# EAGLE design 9doFORK (EAGLE 8.2.2)
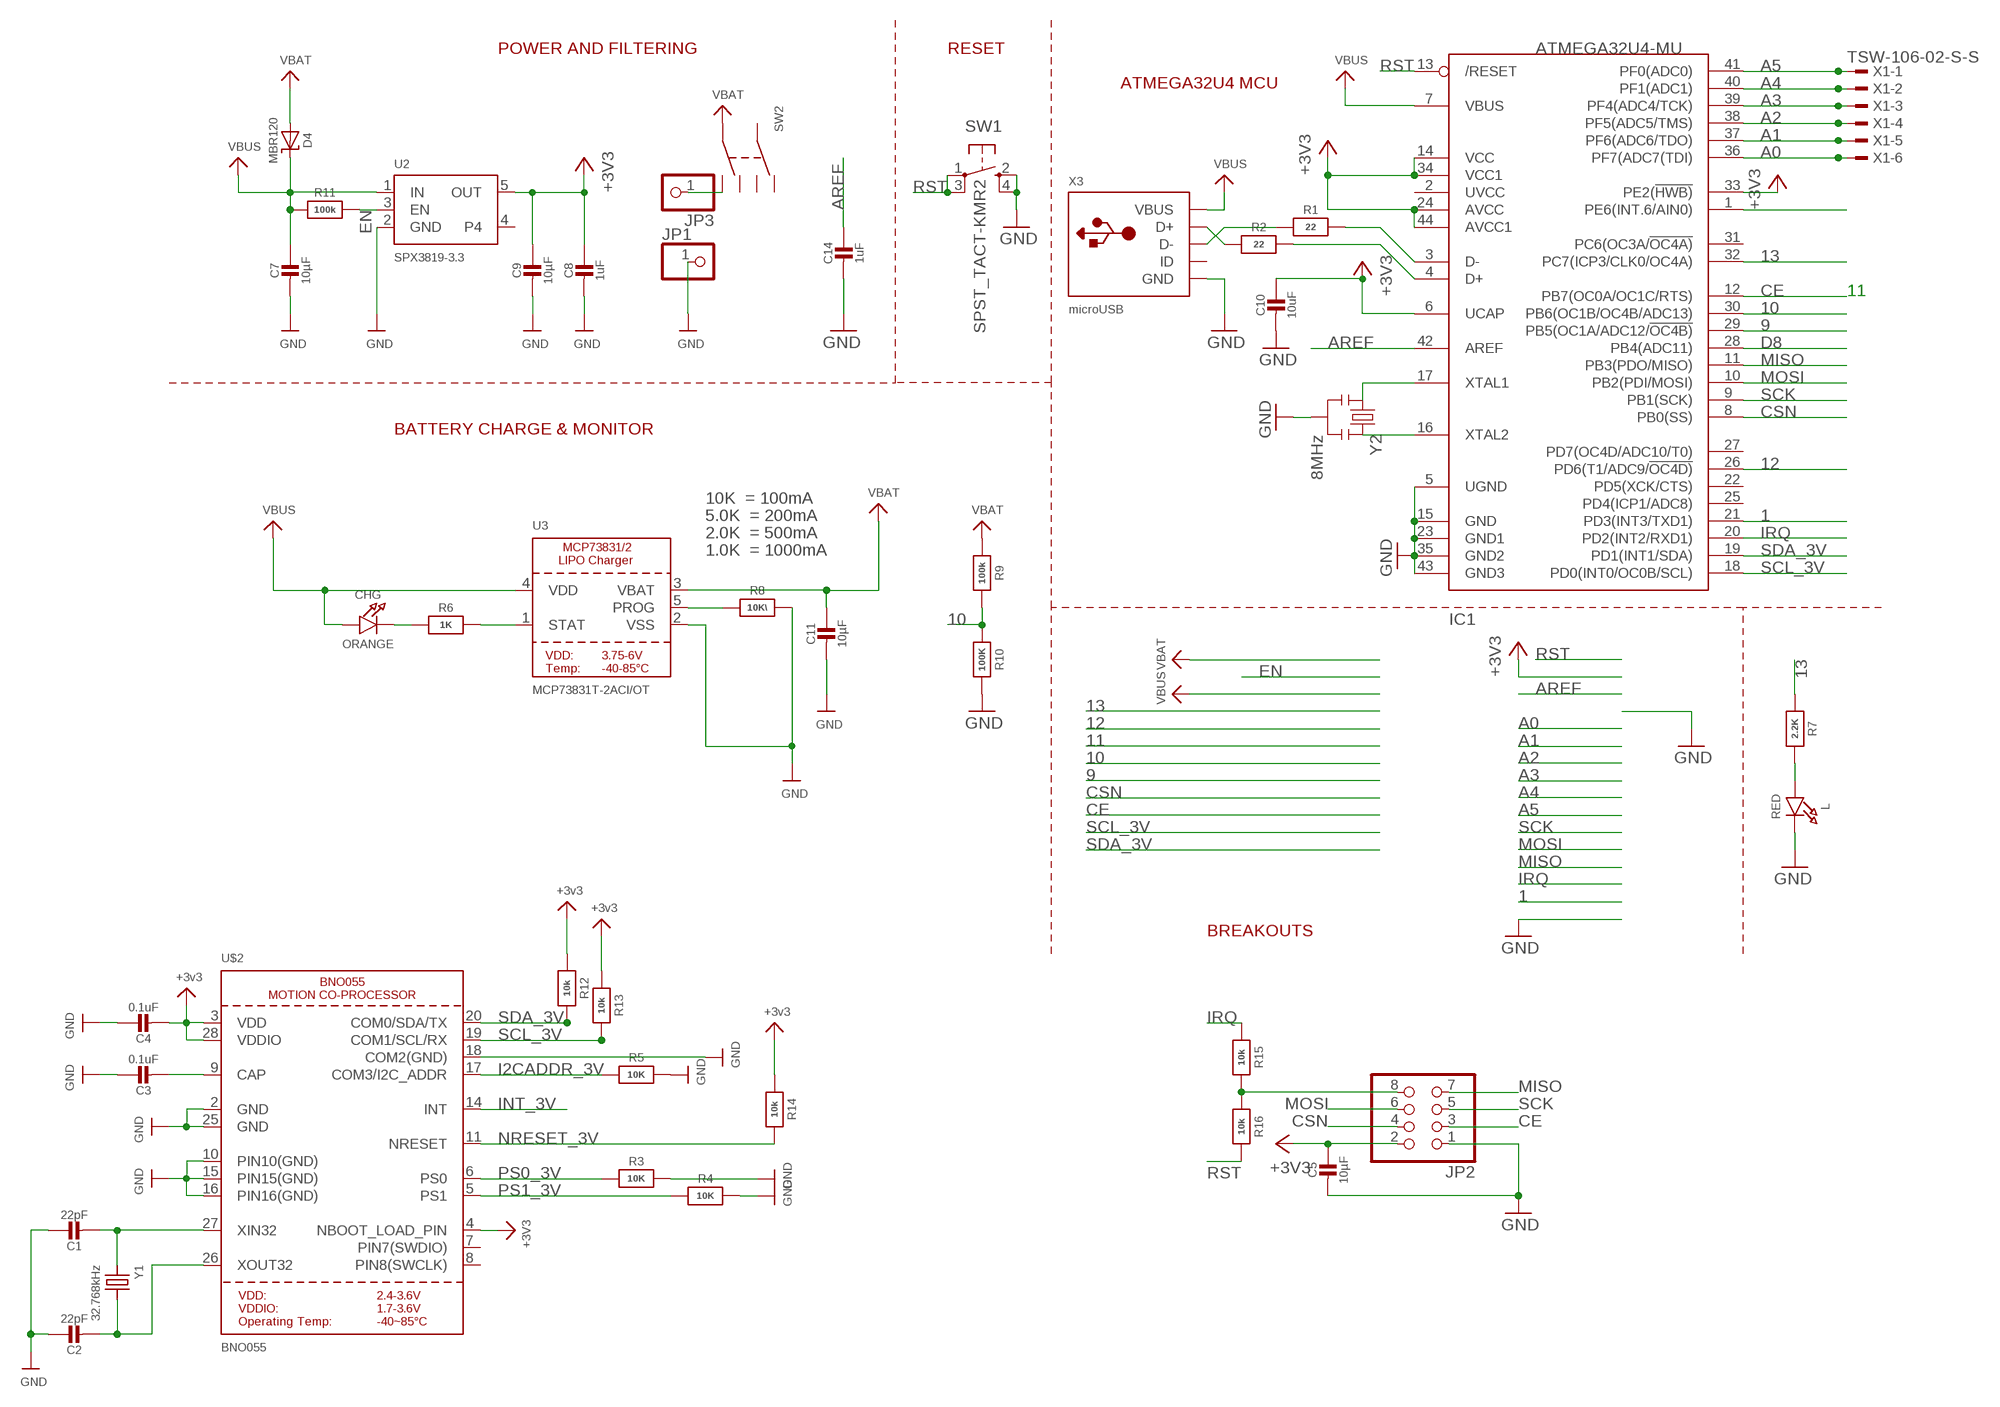
[diagram p0: schematic, sheet 1]

## Parts
C1  22pF  CAP_CERAMIC_0603  [_0603]
C2  22pF  CAP_CERAMIC_0603  [_0603]
C3  0.1uF  CAP_CERAMIC0603MINI  [0603-MINI]
C4  0.1uF  CAP_CERAMIC_0603  [_0603]
C5  10µF  CAP_CERAMIC0805-NOOUTLINE  [0805-NO]
C7  10µF  CAP_CERAMIC0805-NOOUTLINE  [0805-NO]
C8  1uF  CAP_CERAMIC0603MINI  [0603-MINI]
C9  10µF  CAP_CERAMIC0805-NOOUTLINE  [0805-NO]
C10  10uF  CAP_CERAMIC0805-NOOUTLINE  [0805-NO]
C11  10µF  CAP_CERAMIC0805-NOOUTLINE  [0805-NO]
C14  1uF  CAP_CERAMIC0603_NO  [0603-NO]
CHG  ORANGE  LED0805_NOOUTLINE  [CHIPLED_0805_NOOUTLINE]
D4  MBR120  DIODE-SCHOTTKYSOD-123  [SOD-123]
IC1  ATMEGA32U4-MU  [TQFN44_7MM]
JP1  PINHD-1X1  [1X01]
JP2  PINHD-2X4  [2X04]
JP3  PINHD-1X1  [1X01]
L  RED  LED0805  [CHIPLED_0805]
R1  22  RESISTOR0603MINI  [0603-MINI]
R2  22  RESISTOR0603MINI  [0603-MINI]
R3  10K  RESISTOR0603MINI  [0603-MINI]
R4  10K  RESISTOR0603MINI  [0603-MINI]
R5  10K  RESISTOR0603MINI  [0603-MINI]
R6  1K  RESISTOR0603MINI  [0603-MINI]
R7  2.2K  RESISTOR0603MINI  [0603-MINI]
R8  10K\  RESISTOR0603MINI  [0603-MINI]
R9  100k  RESISTOR0603MINI  [0603-MINI]
R10  100K  RESISTOR0603MINI  [0603-MINI]
R11  100k  RESISTOR0603MINI  [0603-MINI]
R12  10k  RESISTOR0603MINI  [0603-MINI]
R13  10k  RESISTOR0603MINI  [0603-MINI]
R14  10k  RESISTOR0603MINI  [0603-MINI]
R15  10k  RESISTOR0603MINI  [0603-MINI]
R16  10k  RESISTOR0603MINI  [0603-MINI]
SW1  SPST_TACT-KMR2  [KMR2]
SW2  SMT-SWITCH  [JS202011JCQN]
U2  SPX3819-3.3  VREG_SOT23-5  [SOT23-5]
U3  MCP73831T-2ACI/OT  MCP73831/2  [SOT23-5]
U$2  BNO055  [BNO055]
X1  TSW-106-02-S-S  [TSW-106-02-S-S]
X3  microUSB  USB_MICRO_20329_V2  [4UCONN_20329_V2]
Y1  32.768kHz  CRYSTAL8.0X3.8  [CRYSTAL_8X3.8]
Y2  8MHz  RESONATORSMD  [RESONATOR-SMD]

## Nets
1: IC1.21(PD3(INT3/TXD1))
9: IC1.29(PB5(OC1A/ADC12/!OC4B))
10: IC1.30(PB6(OC1B/OC4B/ADC13)) R9.2 R10.1
12: IC1.26(PD6(T1/ADC9/!OC4D))
13: IC1.32(PC7(ICP3/CLK0/OC4A)) R7.1
+3V3: C4.2 C5.1 C8.1 C9.1 C10.1 IC1.6(UCAP) IC1.14(VCC) IC1.24(AVCC) IC1.33(PE2(!HWB)) IC1.34(VCC1) IC1.44(AVCC1) JP2.2 R12.1 R13.1 R14.1 U2.5(OUT) U$2.3(VDD) U$2.4(NBOOT_LOAD_PIN) U$2.28(VDDIO) ; supply symbol labelled +3v3
A0: IC1.36(PF7(ADC7(TDI)) X1.6
A1: IC1.37(PF6(ADC6/TDO)) X1.5
A2: IC1.38(PF5(ADC5/TMS)) X1.4
A3: IC1.39(PF4(ADC4/TCK)) X1.3
A4: IC1.40(PF1(ADC1)) X1.2
A5: IC1.41(PF0(ADC0)) X1.1
AREF: C14.1 IC1.42(AREF)
CE: IC1.12(PB7(OC0A/OC1C/RTS)) JP2.3
CSN: IC1.8(PB0(SS)) JP2.4
D8: IC1.28(PB4(ADC11))
D+: IC1.4(D+) R2.2
D-: IC1.3(D-) R1.2
EN: R11.2 U2.3(EN)
GND: C1.1 C2.1 C3.1 C4.1 C5.2 C7.2 C8.2 C9.2 C10.2 C11.2 C14.2 IC1.5(UGND) IC1.15(GND) IC1.23(GND1) IC1.35(GND2) IC1.43(GND3) JP1.1 JP2.1 L.C R3.2 R4.2 R5.2 R8.2 R10.2 SW1.2(S) SW1.4(S1) U2.2(GND) U3.2(VSS) U$2.2(GND) U$2.10(PIN10(GND)) U$2.15(PIN15(GND)) U$2.16(PIN16(GND)) U$2.18(COM2(GND)) U$2.25(GND) X3.BASE@1(GND) X3.BASE@2(GND) X3.GND X3.SPRT@1(GND) X3.SPRT@2(GND) X3.SPRT@3(GND) X3.SPRT@4(GND) Y2.2
I2CADDR_3V: R5.1 U$2.17(COM3/I2C_ADDR)
INT_3V: U$2.14(INT)
IRQ: IC1.20(PD2(INT2/RXD1)) R15.1
MISO: IC1.11(PB3(PDO/MISO)) JP2.7
MOSI: IC1.10(PB2(PDI/MOSI)) JP2.6
N$1: C1.2 U$2.27(XIN32) Y1.P$1
N$2: C2.2 U$2.26(XOUT32) Y1.P$4
N$3: C3.2 U$2.9(CAP)
N$4: L.A R7.2
N$5: CHG.C R6.1
N$6: R6.2 U3.1(STAT)
N$7: R8.1 U3.5(PROG)
N$11: IC1.16(XTAL2) Y2.3
N$12: IC1.17(XTAL1) Y2.1
N$13: JP2.8 R15.2 R16.1
N$14: JP3.1 SW2.1
N$15: R2.1 X3.D+
N$16: R1.1 X3.D-
N$20: IC1.1(PE6(INT.6/AIN0))
NRESET_3V: R14.2 U$2.11(NRESET)
PS0_3V: R3.1 U$2.6(PS0)
PS1_3V: R4.1 U$2.5(PS1)
RST: IC1.13(/RESET) R16.2 SW1.1(P) SW1.3(P1)
SCK: IC1.9(PB1(SCK)) JP2.5
SCL_3V: IC1.18(PD0(INT0/OC0B/SCL)) R13.2 U$2.19(COM1/SCL/RX)
SDA_3V: IC1.19(PD1(INT1/SDA)) R12.2 U$2.20(COM0/SDA/TX)
VBAT: C11.1 D4.A R9.1 SW2.2 U3.3(VBAT)
VBUS: C7.1 CHG.A D4.C IC1.7(VBUS) R11.1 U2.1(IN) U3.4(VDD) X3.VBUS
Unconnected: IC1.2(UVCC) IC1.22(PD5(XCK/CTS)) IC1.25(PD4(ICP1/ADC8)) IC1.27(PD7(OC4D/ADC10/T0)) IC1.31(PC6(OC3A/!OC4A)) SW2.3 SW2.4 SW2.5 SW2.6 U2.4 U$2.7(PIN7(SWDIO)) U$2.8(PIN8(SWCLK)) X3.ID

## Notes on the sheet
- POWER AND FILTERING | RESET
- ATMEGA32U4 MCU
- 11
- BATTERY CHARGE & MONITOR
- 10K  = 100mA
- 5.0K  = 200mA
- 2.0K  = 500mA
- 1.0K  = 1000mA
- BREAKOUTS

## Library data of the parts
C1-C5 C7-C11 C14 = microbuilder:CAP_CERAMIC: Ceramic Capacitors For new designs, use the packages preceded by an '_' character since they are more reliable: The following footprints should be used on most boards: _0402 - Standard footprint for regular board layouts _0603 - Standard footprint for regular board layouts _0805 - Standard footprint for regular board layouts _1206 - Standard footprint for regular board layouts For extremely tight-pitch boards where space is at a premium, the following 'micro-pitch' footprints can be used (smaller pads, no silkscreen outline, etc.): _0402MP - Micro-pitch footprint for very dense/compact boards _0603MP - Micro-pitch footprint for very dense/compact boards _0805MP - Micro-pitch footprint for very dense/compact boards _1206MP - Micro-pitch footprint for very dense/compact boards
CHG L = microbuilder:LED: LED 0603 - 0603 Surface Mount Package 2mA: Green LED - Low Power (3.9mcd, 2ma, 1.7Vf) - Digikey: 475-2709-2-ND Orange LED - Low Power (9.8mcd, 2ma, 1.8Vf) - Digikey: 475-1194-2-ND Red LED - Low Power (5mcd, 2ma, 1.8Vf) - Digikey: 475-1195-2-ND Yellow LED - Low Power (7mcd, 2ma, 1.8Vf) - Digikey: 475-1196-2-ND 5mA: Blue LED - Low Power (17mcd, 5ma, 2.9Vf) - Digikey: LNJ937W8CRACT-ND 0805 - 0805 Surface Mount Package 2mA: Red LED (8.8mcd, 2mA, 1.8Vf, Clear) - Low Power [Digikey: 475-2510-1-ND] Green LED (5mcd, 2mA, 1.8Vf, Clear) - Low Power [Digikey: 475-2730-1-ND] Yellow LED (11.3mcd, 2mA, 1.8Vf, Clear) - Low Power [Digikey: 475-2555-1-ND] 20mA: Red LED (104mcd, 20mA, Diffused) - LS R976 [Digikey: 475-1278-6-ND] Red LED (12mcd, 20mA, 2.0Vf, Clear) - APT2012EC [Digikey: 754-1128-1-ND] Green LED (15mcd, 20mA, 2.2Vf, Clear) - APT2012GC [Digikey: 754-1131-1-ND] Orange LED (160mcd, 20mA, 2.1Vf, Clear) - APT2012SECK [Digikey: 754-1130-1-ND] 1206 - 1206 Surface Mount Package Green LED (26mcd, 20mA, Diffused) - LG N971 [Digikey: 475-1407-6-ND] Red LED (15mcd, 20mA, Diffused) - LH N974 [Digikey: 475-1416-6-ND] Cree - Cree High-Power Surface Mount LEDs XPEBWT-L1-0000-00D50 - White 111lm 350mA 2.9Vf 6200K 110° XTEAWT-00-0000-00000LEE3 - White 114lm 350mA 2.85Vf 5000K 115° Everlight - Everlight 45-21 Series Surface Mount LEDs 45-21/QK2C-B2832AC2CB2/2T - Warm White 2000mcd 20mA 3.25Vf 3050K 120° 45-21/LK2C-B38452C4CB2/2T - Nuetral White 2000mcd 20mA 3.25Vf 4150K 120° 45-21/LK2C-B50634C6CB2/2T - Cold White 2200mcd 20mA 3.25Vf 5650K 120° PLCC2 Reverse Mount LS T77K-J1L2-1-0-2-R18-Z - Red 11.25mcd 2mA 1.8Vf 630nm 120° LO T77K-L1M2-24-Z - Orange 19.6mcd 2mA 1.8Vf 606nm 120° LY T77K-K2M1-26-Z - Yellow 15.7mcd 2mA 1.8Vf 587nm 120°
D4 = microbuilder:DIODE-SCHOTTKY
IC1 = microbuilder:ATMEGA32U4: http://www.ladyada.net/library/eagle
JP1 JP3 = pinhead:PINHD-1X1: PIN HEADER
JP2 = pinhead:PINHD-2X4: PIN HEADER
R1-R16 = microbuilder:RESISTOR: Resistors For new designs, use the packages preceded by an '_' character since they are more reliable: The following footprints should be used on most boards: _0402 - Standard footprint for regular board layouts _0603 - Standard footprint for regular board layouts _0805 - Standard footprint for regular board layouts _1206 - Standard footprint for regular board layouts For extremely tight-pitch boards where space is at a premium, the following 'micro-pitch' footprints can be used (smaller pads, no silkscreen outline, etc.): _0402MP - Micro-pitch footprint for very dense/compact boards _0603MP - Micro-pitch footprint for very dense/compact boards _0805MP - Micro-pitch footprint for very dense/compact boards _1206MP - Micro-pitch footprint for very dense/compact boards
SW1 = adafruit:SPST_TACT: SMT 6mm switch, EVQQ2 series http://www.ladyada.net/library/eagle
SW2 = food-opera:SMT-SWITCH: http://www.digikey.com/scripts/DkSearch/dksus.dll?Detail&itemSeq=231292163&uq=636336732238366195
U2 = microbuilder:VREG_SOT23-5: SOT23-5 Fixed Voltage Regulators Part Current Out V Out V In V Dropout θJA (°C/W) TJ (°C) Digikey Part No. ADP121 150mA 3.3V 3.4-5.5V 0.09V @ 150mA -- -- ADP121-AUJZ33R7CT-ND ADP121 150mA 3.0V 3.1-5.5V 0.09V @ 150mA -- -- ADP121-AUJZ30R7CT-ND ADP122 300mA 3.3V 3.4-5.5V 0.085V @ 300mA -- -- ADP122AUJZ-3.3-R7CT-ND ADP1712 300mA 3.3V 3.5-5.5V 0.17V @ 300mA -- -- ADP1712AUJZ-3.3-R7TR-ND AP7311 (Low Cost) 150mA 3.3V 3.5-6V 0.15V @ 150mA -- -- AP7311-33WG-7DICT-ND LD39015M18R 150mA 1.8V 1.9V-5.5V 0.08V @ 100mA -- -- 497-6977-1-ND LP2985A-33DBVR 150mA 3.3V 3.3-16V 0.28V @ 150mA 206 150 296-18479-1-ND MCP1824T-3302E/OT 300mA 3.3V 3.5V-6V 0.2V @ 300mA -- -- MCP1824T-3302E/OTCT-ND MIC5205-2.5YM5 TR 150mA 2.5V 2.7-16V 0.165V @ 150mA -- -- 576-1257-2-ND MIC5205-3.0YM5 TR 150mA 3.0V 3.2V-16V 0.165V @ 150mA -- -- 576-1258-2-ND MIC5205-3.3YM5 TR 150mA 3.3V 3.5V-16V 0.165V @ 150mA -- -- 576-1259-2-ND TPS780330220 150mA 3.3V+2.2V 3.6-5.5V 250mV Max -- -- 296-23332-1-ND TDA3663/N1,135 100mA 3.3V 3.5-45V 0.18V @ 50mA -- -- 568-5343-1-ND Max operating temp can be calculated using θJA, TJ (max junction temperature), and power in watts. Set the "Maximum Ambient Temperature" until it reaches TJ ("Max Junction Temperature"), which is the absolute limit for safe use of the regulator: Heat Sink Temperature Calculator <http://www.daycounter.com/Calculators/Heat-Sink-Temperature-Calculator.phtml> For example, With 12V source into a 3.3V LP2985 and a 30mA load, we are dissipating (12V-3.3V) * 0.03A = 0.261W. With a θJA of 206 °C/W, a TJ of 150°C, and 261mW we can safely use the chip without a heat sink up to 75°C (=147.1°C Junction Temperature).
U3 = microbuilder:MCP73831/2: MCP73831/2 LIPO Charger VDD: 3.75 - 6V Temp -40 - 85°C Programmable Charge Rate: 15-500mA NOTE: STAT is a tri-state logic output on the MCP73831 and an open-drain output on the MCP73832. SOT23-5 with 4.2V output and tri-state logic on STAT = MCP73831T-2ACI/OT
U$2 = microbuilder:BNO055: BNO055 - Motion Co-Processor
X1 = con-samtec:TSW-106-02-S-S: THROUGH-HOLE .025" SQ POST HEADER Source: Samtec TSW.pdf; OC_FARNELL: unknown; OC_NEWARK: unknown
X3 = microbuilder:USB: USB Connectors USBMINIB - Surface Mount Female Mini-B USB Connector 4UConnector: 06564
Y1 = microbuilder:CRYSTAL: Crystals HC49UP - Surface Mount Crystal 4.0MHz 18pF +/-30ppm Surface Mount Crystal [Digikey: 535-9857-1-ND] 12.0 MHz Surface Mount Crystal [Digikey: 535-9869-6-ND] 25.0 MHz Surface Mount Crystal [Digikey: 535-9078-1-ND] 2.5 x 2.0mm - MEMs SMT Crystal 16.0 MHz 10pF 20ppm 2.5 x 2.0mm Crystal [Digikey -40-85°C: 535-10923-1-ND] 3.2 x 2.5mm - MEMs SMT Crystal 12.0 MHz 8pF 15ppm 3.2 x 2.5mm Crystal [Digikey: -10-70°C: 644-1047-1-ND -40-125°C: 644-1128-1-ND] 40~85°C cheaper: 644-1173-6-ND 16.0 MHz 8pF 15ppm 3.2 x 2.5mm Crystal [Digikey: -10-70°C: 644-1049-1-ND -40-125°C: 644-1129-2-ND]-40~85°C cheaper: 644-1175-6-ND 16.0 MHz 10pF 10ppm 3.2 x 2.5mm Crystal [Digikey: 644-1100-1-ND] 27.12 MHz 18pF 30ppm 3.2 x 2.5mm Crystal [Digikey: 887-1424-1-ND] 27.12MHz 10pF 10ppm 3.2 x 2.5mm Crystal [Digikey: 887-1329-1-ND] 4.9 x 1.8mm - MEMs SMT Crystal 32.768 KHz 12.5pF 20ppm 4.9 x 1.8mm Crystal [Digikey: SE2415CT-ND] 8.0 x 3.8mm - Surface Mount Crystal 32.768kHz 12.5pF 20ppm -40°C-85°C [Digikey: 535-9166-2-ND] Cylinder 32.768KHz Cylinder Crystal (2x6mm body) [Ex. Digikey: 300-8341-2-ND]
Y2 = SparkFun:RESONATOR: Resonator Small SMD resonator. This is the itty bitty 10/20MHz resonators with built in caps. CSTCE10M0G55 and CSTCE20M0V53. Footprint has been reviewed closely but hasn't been tested yet.

## Board
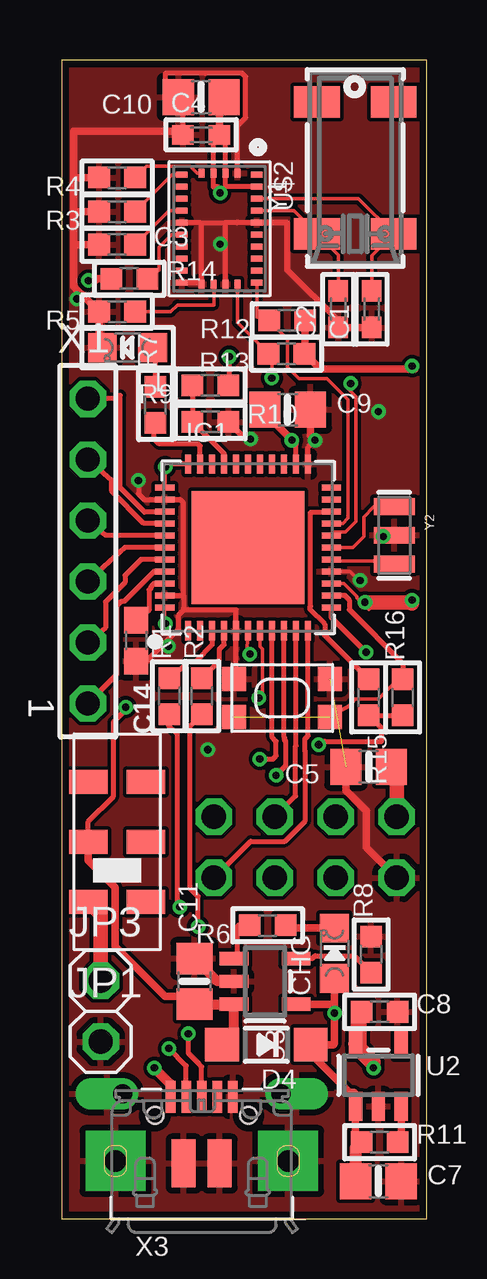
[diagram p1: board, top side]
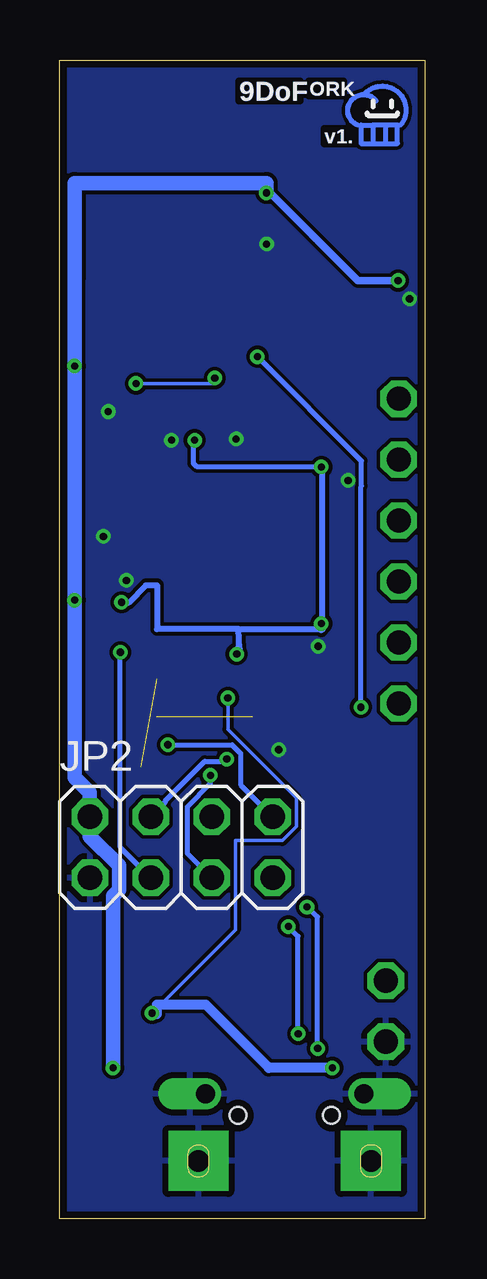
[diagram p2: board, bottom side, seen from below]

Size 15.22 x 48.31 mm. Coordinates in mm from the lower left corner, seen from the top.
Outline: 0,0 15.22,0 15.22,48.31 0,48.31 0,0
Copper layers (1*16): Top 0.035mm / dielectric 1.5mm / Bottom 0.035mm
Design rules "default *": minimum track width 6mil, minimum drill 0.3mm, track to track 6mil, track to pad 6mil, pad to pad 6mil, via to via 6mil, smd to smd 6mil, copper to edge 12mil, drill to drill 6mil, minimum pad ring 10mil, minimum via ring 6mil, stop-mask expansion 4mil, vias tented up to drill 0mil, thermal gap 10mil

### Footprints (pad centres in the part's own frame; a part is rotated, then mirrored left to right if it is on the bottom)
_0603 = smd 0.9 x 0.8: 1 -0.762,0; 2 0.762,0
0603-MINI = smd 0.9 x 0.9: 1 -0.75,0; 2 0.75,0
0805-NO = smd 1.3 x 1.5: 1 -0.95,0; 2 0.95,0
0603-NO = smd 1.1 x 1: 1 -0.85,0; 2 0.85,0
CHIPLED_0805_NOOUTLINE = smd 1.2 x 1.2: A 0,-1.05; C 0,1.05
SOD-123 = smd 1.4 x 1.4: A 1.85,0; C -1.85,0
TQFN44_7MM = smd 0.25 x 0.8: 1 -2.5,-3.475; 2 -2,-3.475; 3 -1.5,-3.475; 4 -1,-3.475; 5 -0.5,-3.475; 6 0,-3.475; 7 0.5,-3.475; 8 1,-3.475; 9 1.5,-3.475; 10 2,-3.475; 11 2.5,-3.475; 23 2.5,3.475; 24 2,3.475; 25 1.5,3.475; 26 1,3.475; 27 0.5,3.475; 28 0,3.475; 29 -0.5,3.475; 30 -1,3.475; 31 -1.5,3.475; 32 -2,3.475; 33 -2.5,3.475 | smd 0.8 x 0.25: 12 3.475,-2.5; 13 3.475,-2; 14 3.475,-1.5; 15 3.475,-1; 16 3.475,-0.5; 17 3.475,0; 18 3.475,0.5; 19 3.475,1; 20 3.475,1.5; 21 3.475,2; 22 3.475,2.5; 34 -3.475,2.5; 35 -3.475,2; 36 -3.475,1.5; 37 -3.475,1; 38 -3.475,0.5; 39 -3.475,0; 40 -3.475,-0.5; 41 -3.475,-1; 42 -3.475,-1.5; 43 -3.475,-2; 44 -3.475,-2.5 | smd 4.7 x 4.7: THERMAL 0,0
1X01 = drill 1.016 octagon: 1 0,0
2X04 = drill 1.016 octagon: 1 -3.81,-1.27; 2 -3.81,1.27; 3 -1.27,-1.27; 4 -1.27,1.27; 5 1.27,-1.27; 6 1.27,1.27; 7 3.81,-1.27; 8 3.81,1.27
CHIPLED_0805 = smd 1.2 x 1.2: A 0,-1.05; C 0,1.05
KMR2 = smd 1 x 1: 1 2,0.8; 2 2,-0.8; 3 -2,0.8; 4 -2,-0.8
JS202011JCQN = smd 1 x 1.6: 1 -2.5,1.2; 2 0,1.2; 3 2.5,1.2; 4 -2.5,-1.2; 5 0,-1.2; 6 2.5,-1.2
SOT23-5 = smd 0.55 x 1.2: 1 -0.95,-1.3; 2 0,-1.3; 3 0.95,-1.3; 4 0.95,1.3; 5 -0.95,1.3
BNO055 = smd 0.25 x 0.475: 1 -2.25,1.562; 6 -2.25,-1.562; 7 -1.75,-1.562; 8 -1.25,-1.562; 9 -0.75,-1.562; 10 -0.25,-1.562; 11 0.25,-1.562; 12 0.75,-1.562; 13 1.25,-1.562; 14 1.75,-1.562; 15 2.25,-1.562; 20 2.25,1.562; 21 1.75,1.562; 22 1.25,1.562; 23 0.75,1.562; 24 0.25,1.562; 25 -0.25,1.562; 26 -0.75,1.562; 27 -1.25,1.562; 28 -1.75,1.562 | smd 0.375 x 0.25: 2 -2.312,0.75; 3 -2.312,0.25; 4 -2.312,-0.25; 5 -2.312,-0.75; 16 2.312,-0.75; 17 2.312,-0.25; 18 2.312,0.25; 19 2.312,0.75
TSW-106-02-S-S = drill 1 pad 1.5 octagon: 1 6.35,0; 2 3.81,0; 3 1.27,0; 4 -1.27,0; 5 -3.81,0; 6 -6.35,0
4UCONN_20329_V2 = smd 1 x 2: BASE@1 -0.75,-2; BASE@2 0.75,-2 | smd 0.4 x 1.35: D+ 0,0.775; D- -0.65,0.775; GND 1.3,0.775; ID 0.65,0.775; VBUS -1.3,0.775 | drill 0.8 pad 1.2 offset: SPRT@1 -3.3,0.9; SPRT@2 3.3,0.9 | drill 0.9 pad 2.5 square: SPRT@3 -3.6,-1.9; SPRT@4 3.6,-1.9 | hole 0.7: -1.95,0; 1.95,0
CRYSTAL_8X3.8 = smd 1.3 x 1.9: P$1 -2.75,-1.6; P$2 2.75,-1.6; P$3 2.75,1.6; P$4 -2.75,1.6
RESONATOR-SMD = smd 0.7 x 1.7: 1 -1.2,0; 2 0,0; 3 1.2,0

### Placement (x,y rotation side)
C1  12.93,37.92 90 top
C2  11.53,37.92 90 top
C3  2.31,40.61 0 top
C4  5.82,45.19 0 top
C5  12.8,18.85 180 top
C7  13.21,1.57 0 top
C8  13.26,8.64 0 top
C9  9.42,33.73 0 top
C10  5.82,46.76 180 top
C11  5.54,9.91 90 top
C14  3.1,24.1 270 top
CHG  11.38,11.07 0 top
D4  8.53,7.26 180 top
IC1  7.77,27.99 0 top
JP1  1.63,7.39 0 top
JP2  10.16,15.49 0 bottom
JP3  1.63,9.93 0 top
L  2.74,36.32 90 top
R1  4.5,21.79 90 top
R2  5.84,21.79 90 top
R3  2.31,41.99 180 top
R4  2.31,43.41 180 top
R5  2.31,37.82 180 top
R6  8.59,12.24 180 top
R7  3.91,33.93 90 top
R8  12.9,11.02 90 top
R9  6.2,34.75 180 top
R10  6.2,33.22 0 top
R11  13.26,3.2 0 top
R12  9.4,37.47 180 top
R13  9.37,36.07 180 top
R14  2.82,39.19 0 top
R15  12.8,21.74 270 top
R16  14.22,21.74 90 top
SW1  9.19,21.72 180 top
SW2  2.31,15.72 90 top
U2  13.21,5.99 0 top
U3  8.48,9.91 270 top
U$2  6.58,41.27 270 top
X1  1.09,27.84 270 top
X3  5.84,4.32 0 top
Y1  12.24,43.81 90 top
Y2  13.87,28.5 270 top

### Tracks (layer width: path | path; a pad name or v marks a point on that pad's centre or on a via)
10
  Top 0.203: IC1.30 6.77,31.9 R10.1 R9.2
13
  Top 0.203: IC1.32 5.77,32.23 5.69,32.31 4.06,32.31 3.86,32.51 3.86,33.13 R7.1
+3V3  (via drill 0.3)
  Top 0.152: 12.8,25.4 12.61,25.6 12.32,25.88 12.32,25.94 11.77,26.49 IC1.14 | IC1.6 7.72,23.77 7.77,23.72 v7.85,23.55 | IC1.44 4.3,24.84 v4.32,24.82 4.24,24.77
  Top 0.203: IC1.33 4.44,31.47 v4.32,31.34 4.27,31.29 4.27,30.52 IC1.34 | IC1.24 9.77,32.29 v9.6,32.46 | U$2.28 6.83,43.02 | 6.83,43.02 U$2.3 6.83,44.94 C4.2 6.33,44.94 U$2.4 6.33,43.02 6.5,43.02 6.6,42.93 v6.61,42.77 6.83,43.02
  Top 0.254: v12.65,25.7 12.65,25.64 12.61,25.6
  Top 0.305: C4.2 6.58,46.57 C10.1 | R14.1 1.47,39.19 1.4,39.12 v1.11,39.12 | R12.1 10.15,36.09 R13.1 10.16,36.07 10.79,35.43 14.73,35.43 14.73,35.44 v14.61,35.56 | C9.1 8.47,33.59 v9.6,32.46
  Top 0.406: U2.5 12.26,8.38 C8.1 12.51,6.79 v13.01,6.3
  Top 0.61: U2.5 13.01,6.55 v13.01,6.3 | JP2.2 13.97,18.63 C5.1 | v12.65,25.7 14.55,25.7 14.61,25.65 v14.61,25.79 v14.61,25.8
  Bottom 0.152: v7.85,23.55 7.77,24.43 7.67,24.54
  Bottom 0.203: v4.32,31.34 9.5,31.34 9.65,31.5 9.65,32.41 v9.6,32.46
  Bottom 0.254: v12.65,25.7 12.34,25.7 11.63,26.42 11.18,26.42 11.18,24.59 7.75,24.59 | 7.75,24.59 4.27,24.59 | 4.27,24.59 4.27,31.29 v4.32,31.34 | v4.32,24.82 4.32,24.54 4.27,24.59 | v7.85,23.55 7.77,23.72 7.72,23.77 7.77,24.57 7.75,24.59
  Bottom 0.305: v1.11,39.12 2.8,39.12 6.61,42.93
  Bottom 0.61: v13.01,6.3 13.01,13.46 12.75,13.72 12.75,14.73 13.97,15.95 JP2.2 13.97,17.77 14.61,18.41 v14.61,25.8 v14.61,35.56 14.61,43.18 | 14.61,43.18 14.61,39.24 | 14.61,43.18 6.6,43.18 6.6,42.93 6.61,42.93 v6.61,42.77
A0
  Top 0.203: IC1.36 4.27,29.46 3.45,29.46 2.44,30.48 2.44,34.34 2.29,34.19 X1.6
A1
  Top 0.203: X1.5 2.08,30.79 2.08,30.33 3.42,28.99 IC1.37
A2
  Top 0.203: IC1.38 1.84,28.49 X1.4
A3
  Top 0.203: IC1.39 2.64,27.99 X1.3
A4
  Top 0.203: IC1.40 3.31,27.49 2.64,26.82 2.64,26.54 1.83,25.72 1.83,24.64 X1.2
A5
  Top 0.203: IC1.41 3.85,26.99 2.62,25.76 2.49,25.76 2.31,25.58 2.31,22.71 X1.1
AREF
  Top 0.203: IC1.42 3.86,26.49 3.72,26.35 3.72,26.3 3.64,26.22 3.64,25.37 C14.1
CE  (via drill 0.3)
  Top 0.203: v12.7,23.62 11.25,25.07 IC1.12
  Bottom 0.203: JP2.3 12.7,15.49 v12.7,23.62
CSN  (via drill 0.3)
  Top 0.203: v8.26,19.17 8.81,19.17 8.94,19.3 8.94,19.91 8.77,20.08 IC1.8
  Bottom 0.203: JP2.4 10.83,17.36 10.83,17.42 9.18,19.07 8.36,19.07 v8.26,19.17 8.13,19.3
D+
  Top 0.203: IC1.4 6.77,23.94 6.58,23.75 6.58,23.28 R2.2
D-
  Top 0.203: IC1.3 6.27,23.95 5.57,23.25 5.29,23.25 4.58,22.54 R1.2
EN
  Top 0.305: U2.3 14.16,3.35 R11.2
GND  (via drill 0.3)  (1 unrouted)
  Top 0.152: Y2.2 13.72,28.45 v13.41,28.45 | IC1.15 12.02,26.99 12.39,26.62
  Top 0.203: v3.2,30.79 3.2,30.22 3.43,29.99 IC1.35 4.93,29.99 5.08,29.84 5.08,25.98 | C14.2 3.54,23.25 4.29,24 | 4.29,24 4.87,24.59 4.87,25.17 5.12,25.42 | 5.08,25.98 5.08,25.45 5.12,25.42 | 5.12,25.42 5.15,25.39 7.27,25.39 IC1.5 7.27,22.59 SW1.2 | IC1.43 5.07,25.99 5.08,25.98 | v4.45,23.88 4.42,23.88 4.29,24 | IC1.23 10.27,32.17 v10.57,32.46 | 7.29,41.52 6.79,41.52 | U$2.25 7.29,41.52 | 5.81,41.52 6.79,41.52 | 5.81,41.52 U$2.10 | U$2.18 6.83,41.49 6.79,41.52 | 5.83,39.04 U$2.16 | 5.83,39.04 5.83,41.51 5.81,41.52 | U$2.15 5.82,39.02 5.83,39.04 | 7.33,41.56 7.29,41.52 | U$2.2 7.33,45.56 7.67,45.91 7.67,47.62 7.52,47.77 6.01,47.77 6,47.75 4.32,47.75 4.32,47.31 C10.2 5.05,46.57 C4.1
  Top 0.254: C2.1 11.53,37.44 9.41,39.56 9.41,41.51 9.4,41.53 U$2.25 | v7.87,32.51 7.66,32.51 R10.2
  Top 0.305: 0.77,38.6 0.86,38.51 0.87,38.51 R5.2 1.56,36.45 L.C | 0.77,38.6 0.51,38.86 0.51,40.49 | 0.51,41.95 0.51,43.34 | 0.51,40.49 0.51,41.95 | 0.51,43.34 0.51,45.34 4.9,45.34 C4.1 | R4.2 0.58,43.41 0.51,43.34 | R3.2 0.55,41.99 0.51,41.95 | C3.1 0.63,40.62 0.51,40.49 | v0.64,38.35 0.64,38.47 0.77,38.6 | C9.2 10.37,32.65 v10.57,32.46 | C1.1 C2.1 | C5.2 11.85,17.87 12.7,17.02 12.7,15.49 JP2.1 | v12.45,26.62 12.39,26.62
  Top 0.406: U3.2 6.49,9.91 6.43,9.96 C11.2
  other vias: 6.6,40.64 13.21,33.66 6.1,19.56
  pour Bottom: 0,50.7 0,0 15.34,0 15.14,12.4 15.29,50.8
  pour Top: 5.56,42.04 5.56,39.5 7.59,39.5 7.59,42.04
  pour Top: 15.24,0 15.24,48.26 0.13,48.26 0,0
I2CADDR_3V
  Top 0.152: R5.1 4.55,37.82 4.83,38.1 6.35,38.1 6.35,38.94 U$2.17
IRQ
  Top 0.203: IC1.20 11.22,29.46 10.38,29.46 10.38,25.54 10.36,25.52 10.36,25.4 10.97,24.79 10.97,24.32 R15.1
MISO
  Top 0.203: JP2.7 7.87,15.75 9.31,15.75 10.16,16.6 10.16,19.51 10.14,19.53 10.14,20.01 10.27,20.14 IC1.11
MOSI
  Top 0.203: JP2.6 9.75,17.63 9.75,19.71 9.77,19.73 IC1.10
N$1
  Top 0.152: U$2.27 12.38,42.52 Y1.P$1 12.93,40.15 C1.2
N$2
  Top 0.152: U$2.26 9.68,42.02 Y1.P$4 11.53,40.18 C2.2
N$3
  Top 0.152: U$2.9 4.47,42.02 C3.2
N$4
  Top 0.203: R7.2 3.91,36.2 L.A
N$5
  Top 0.305: CHG.C 9.45,12.12 R6.1
N$6
  Top 0.203: R6.2 7.37,12.24 7.32,12.19 7.32,10.99 U3.1
N$7
  Top 0.203: U3.5 10.45,10.86 10.57,10.97 12.2,10.97 R8.1
N$8
  Bottom 0.203: 2.16,44.83 2.67,44.83 2.67,45.59 2.16,45.59 | 2.16,44.83 1.65,44.83 | 1.65,44.83 1.14,44.83 1.14,45.59 1.65,45.59 | 1.65,45.59 2.16,45.59 | 2.16,45.59 2.16,44.83 | 1.65,45.59 1.65,44.83
N$9
  Bottom 0.203: 2.79,45.59 arc211 2.03,46.61
N$10
  Bottom 0.203: 2.54,46.86 arc180 1.02,45.59
N$11
  Top 0.152: Y2.3 13.85,27.43 12.8,27.43 11.31,27.43 IC1.16
N$12
  Top 0.152: IC1.17 12.14,27.99 12.6,28.45 12.6,29.26 13.01,29.67 13.84,29.67 Y2.1
N$13  (via drill 0.3)
  Top 0.203: v10.72,19.77 10.77,19.72 10.77,19.71 10.97,19.91 13.35,19.91 13.35,20.45 R15.2 R16.1
  Bottom 0.203: JP2.8 7.68,18.09 7.68,19.41 8.04,19.77 v10.72,19.77
N$14
  Top 0.61: JP3.1 1.63,12.71 SW2.1
N$15  (via drill 0.3)
  Top 0.203: X3.D+ 5.84,6.35 5.73,6.46 5.28,6.91 v5.28,7.72 | v5.69,12.19 5.69,13.45 5.33,13.8 5.33,20.54 R2.1
  Bottom 0.203: v5.28,7.72 5.28,11.79 v5.69,12.19
N$16  (via drill 0.3)
  Top 0.203: X3.D- 5.19,6.39 v4.47,7.11 | v4.92,13.01 4.83,13.1 4.83,20.19 4.45,20.57 R1.1
  Bottom 0.203: v4.47,7.11 4.47,12.6 4.88,13.01 v4.92,13.01
NRESET_3V
  Top 0.152: U$2.11 4.58,41.02 4.06,40.51 4.06,39.56 R14.2
PS0_3V
  Top 0.152: U$2.6 4.6,43.52 R3.1
PS1_3V
  Top 0.152: U$2.5 5.64,43.59 5.35,43.88 3.53,43.88 R4.1
RST  (1 unrouted)
  Top 0.152: SW1.3 12.12,21.46 12.12,21.54 12.26,21.67 13.2,21.67 14.03,22.49 R16.2
  Top 0.203: IC1.13 11.8,25.99 11.99,25.81 11.99,25.4 14.22,23.16 R16.2
SCK  (via drill 0.3)
  Top 0.203: v8.94,18.49 9.35,18.9 9.35,19.91 9.3,19.96 9.3,20.06 9.27,20.09 IC1.9
  Bottom 0.203: v8.94,18.49 8.94,18.15 9.91,17.18 9.91,15.24 JP2.5
SCL_3V  (via drill 0.3)
  Top 0.152: U$2.19 7.33,37.36 R13.2 8.76,35.93 v8.76,35.05 | IC1.18 11.39,28.64 11.83,28.64 12.27,29.07 12.27,34.29 11.94,34.62 11.94,34.8 12.02,34.8 v12.05,34.83
  Bottom 0.152: v12.05,34.83 8.86,34.83 8.64,35.05 v8.76,35.05
SDA_3V
  Top 0.152: U$2.20 8.14,37.59 8.61,37.47 | 8.61,37.47 R12.2 | IC1.19 11.72,28.99 11.94,29.21 11.94,34.15 11.06,35.03 9.9,35.03 9.42,35.51 9.42,36.62 9.44,36.65 8.61,37.47
VBAT  (via drill 0.3)
  Top 0.203: SW2.2 1.11,16.56 2.17,17.62 2.17,20.71 2.67,21.21 v2.67,21.34 | v6.99,35.94 6.99,34.78 R9.1
  Top 0.305: SW2.2 1.11,14.95 2.23,13.83 2.23,11.35 4.32,9.27 5.22,9.27 C11.1
  Top 0.406: D4.A 7.18,7.76 U3.3 C11.1
  Bottom 0.203: v2.67,21.34 2.67,30.53 2.64,30.55 2.64,31.6 v6.99,35.94
VBUS  (via drill 0.3)
  Top 0.152: IC1.7 8.27,23.87 8.38,23.77 8.38,21.97 8.13,21.72 v8.22,21.72
  Top 0.305: 12.26,2.95 U2.1 12.26,5.22 12.19,5.28 11.99,5.28 10.38,6.89 D4.C 11.33,7.26 11.38,7.32 v11.38,8.58 11.38,8.94 | 11.38,8.94 CHG.A | U3.4 9.8,8.94 11.38,8.94
  Top 0.406: v3.86,6.3 4.54,5.62 X3.VBUS
  Top 0.508: C7.1 12.26,2.95 R11.1
  Bottom 0.152: v8.22,21.72 8.22,20.41 5.36,17.56 5.36,16.35 5.94,15.77 7.9,15.77 7.9,12.06 v11.38,8.58
  Bottom 0.406: v3.86,6.3 6.5,6.3 9.14,8.94 11.18,8.94 11.18,8.58 | 11.18,8.53 11.18,8.58 | v11.38,8.58 11.18,8.58

### Text on the board
Bottom: ORK | 9DoF | v1.
bPlace: ORK | 9DoF | v1.